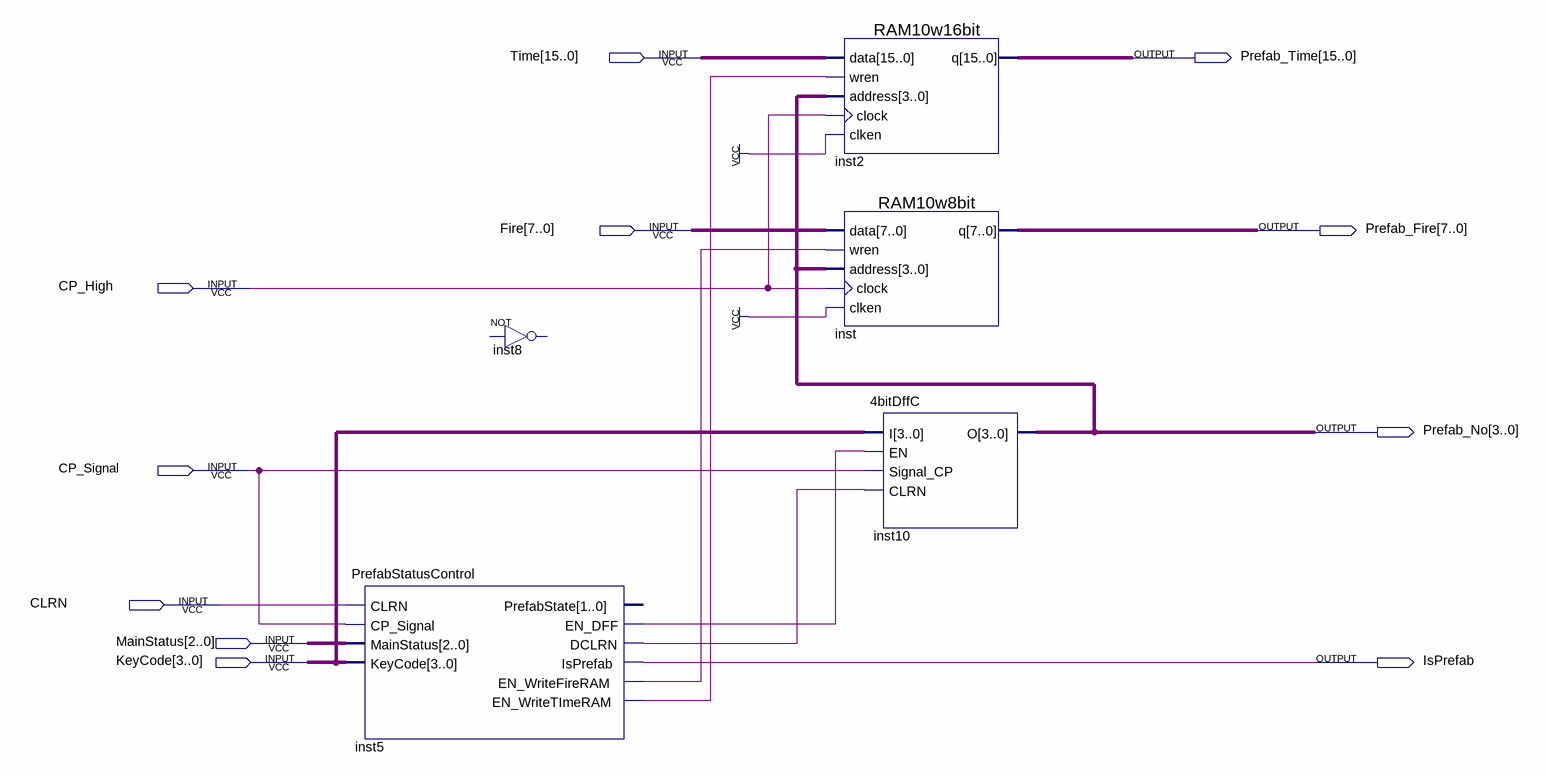
[diagram p0: schematic sheet]
// Quartus schematic PrefabStatus.bdf as structural Verilog: 5 symbols, 11 pins
module PrefabStatus (
  input  [15:0] Time,
  input  [7:0] Fire,
  input  CP_High,
  input  CP_Signal,
  input  CLRN,
  input  [2:0] MainStatus,
  input  [3:0] KeyCode,
  output [15:0] Prefab_Time,
  output [7:0] Prefab_Fire,
  output [3:0] Prefab_No,
  output IsPrefab
);

  wire inst5_dclrn, inst5_en_dff, inst5_en_writefireram, inst5_en_writetimeram;

  PrefabStatusControl inst5 (
    .CLRN(CLRN), .CP_Signal(CP_Signal), .MainStatus(MainStatus), .KeyCode(KeyCode), .EN_DFF(inst5_en_dff),
    .DCLRN(inst5_dclrn), .IsPrefab(IsPrefab), .EN_WriteFireRAM(inst5_en_writefireram),
    .EN_WriteTImeRAM(inst5_en_writetimeram));  // open: PrefabState
  // NOT inst8 is placed but not wired
  RAM10w16bit inst2 (
    .data(Time), .wren(inst5_en_writetimeram), .address(Prefab_No), .clock(CP_High), .clken(1'b1),
    .q(Prefab_Time));
  RAM10w8bit inst (
    .data(Fire), .wren(inst5_en_writefireram), .address(Prefab_No), .clock(CP_High), .clken(1'b1),
    .q(Prefab_Fire));
  \4bitDffC  inst10 (.I(KeyCode), .EN(inst5_en_dff), .Signal_CP(CP_Signal), .CLRN(inst5_dclrn), .O(Prefab_No));
endmodule
